# Vivado block design base, xc7z020clg400-1, Vivado 2020.1
# (continued, part 2 of 4)
current_bd_instance /video

create_bd_cell -type hier hdmi_in
create_bd_cell -type hier hdmi_out
create_bd_cell -type ip -vlnv xilinx.com:ip:proc_sys_reset:5.0 proc_sys_reset_pixelclk
create_bd_cell -type ip -vlnv xilinx.com:ip:xlconcat:2.1 xlconcat_0
set_property -dict {CONFIG.NUM_PORTS 6} [get_bd_cells xlconcat_0]
create_bd_cell -type ip -vlnv xilinx.com:ip:axi_interconnect:2.1 axi_interconnect_0
set_property -dict [list \
  CONFIG.M00_HAS_REGSLICE 1 \
  CONFIG.M01_HAS_REGSLICE 1 \
  CONFIG.M02_HAS_REGSLICE 1 \
  CONFIG.M03_HAS_REGSLICE 1 \
  CONFIG.M04_HAS_REGSLICE 1 \
  CONFIG.M05_HAS_REGSLICE 1 \
  CONFIG.M06_HAS_REGSLICE 1 \
  CONFIG.M07_HAS_REGSLICE 1 \
  CONFIG.M08_HAS_REGSLICE 1 \
  CONFIG.M09_HAS_REGSLICE 1 \
  CONFIG.NUM_MI 10 \
  CONFIG.S00_HAS_REGSLICE 1 \
] [get_bd_cells axi_interconnect_0]
create_bd_cell -type ip -vlnv xilinx.com:ip:axi_interconnect:2.1 axi_mem_intercon
set_property -dict {CONFIG.NUM_MI 1 CONFIG.NUM_SI 2} [get_bd_cells axi_mem_intercon]
create_bd_cell -type ip -vlnv xilinx.com:ip:axi_vdma:6.3 axi_vdma
set_property -dict [list \
  CONFIG.c_m_axi_mm2s_data_width 32 \
  CONFIG.c_m_axis_mm2s_tdata_width 32 \
  CONFIG.c_mm2s_genlock_mode 1 \
  CONFIG.c_mm2s_linebuffer_depth 512 \
  CONFIG.c_mm2s_max_burst_length 32 \
  CONFIG.c_num_fstores 4 \
  CONFIG.c_s2mm_genlock_mode 0 \
  CONFIG.c_s2mm_linebuffer_depth 4096 \
  CONFIG.c_s2mm_max_burst_length 32 \
] [get_bd_cells axi_vdma]

# ---- hierarchy /video/hdmi_in ----
current_bd_instance /video/hdmi_in
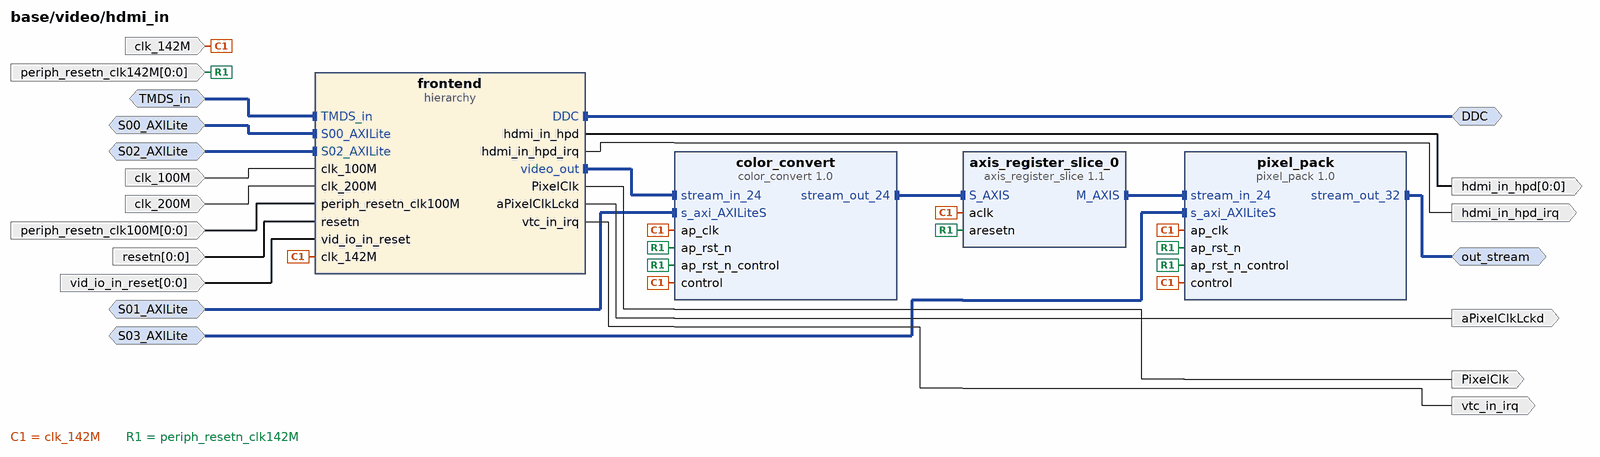
[diagram p19: block diagram inside /video/hdmi_in]
create_bd_intf_pin -mode Master -vlnv xilinx.com:interface:iic_rtl:1.0 DDC
create_bd_intf_pin -mode Slave -vlnv xilinx.com:interface:aximm_rtl:1.0 S00_AXILite
create_bd_intf_pin -mode Slave -vlnv xilinx.com:interface:aximm_rtl:1.0 S01_AXILite
create_bd_intf_pin -mode Slave -vlnv xilinx.com:interface:aximm_rtl:1.0 S02_AXILite
create_bd_intf_pin -mode Slave -vlnv xilinx.com:interface:aximm_rtl:1.0 S03_AXILite
create_bd_intf_pin -mode Slave -vlnv digilentinc.com:interface:tmds_rtl:1.0 TMDS_in
create_bd_intf_pin -mode Master -vlnv xilinx.com:interface:axis_rtl:1.0 out_stream
create_bd_pin -dir O -type clk PixelClk
create_bd_pin -dir O aPixelClkLckd
create_bd_pin -dir I -type clk clk_100M
create_bd_pin -dir I -type clk clk_142M
create_bd_pin -dir I -type clk clk_200M
create_bd_pin -dir O -from 0 -to 0 hdmi_in_hpd
create_bd_pin -dir O -type intr hdmi_in_hpd_irq
create_bd_pin -dir I -from 0 -to 0 -type rst periph_resetn_clk100M
create_bd_pin -dir I -from 0 -to 0 -type rst periph_resetn_clk142M
create_bd_pin -dir I -from 0 -to 0 -type rst resetn
create_bd_pin -dir I -from 0 -to 0 -type rst vid_io_in_reset
create_bd_pin -dir O -type intr vtc_in_irq

create_bd_cell -type hier frontend
create_bd_cell -type ip -vlnv xilinx.com:ip:axis_register_slice:1.1 axis_register_slice_0
create_bd_cell -type ip -vlnv xilinx.com:hls:color_convert:1.0 color_convert
create_bd_cell -type ip -vlnv xilinx.com:hls:pixel_pack:1.0 pixel_pack

# ---- hierarchy /video/hdmi_in/frontend ----
current_bd_instance /video/hdmi_in/frontend
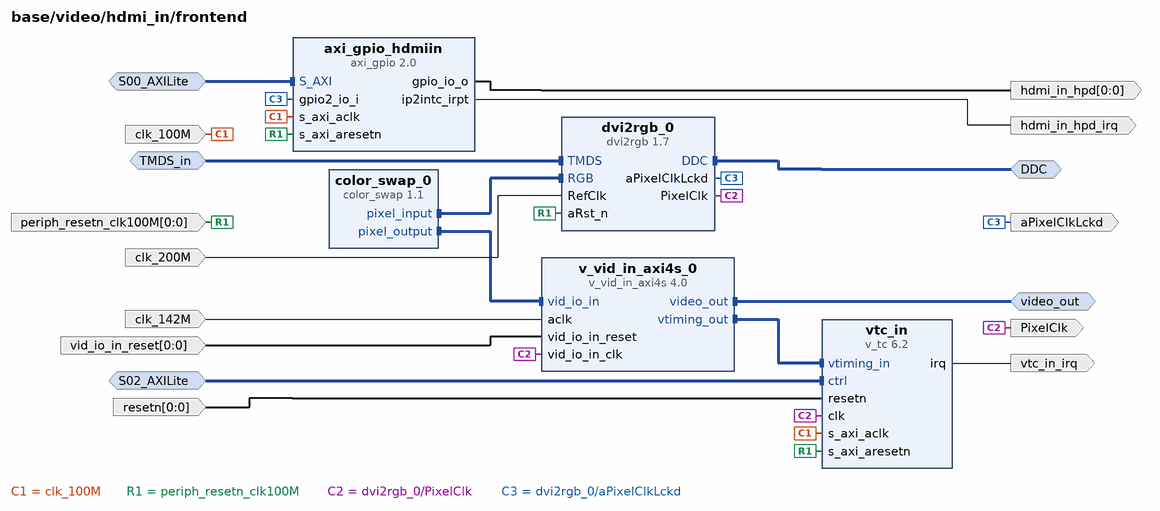
[diagram p20: block diagram inside /video/hdmi_in/frontend]
create_bd_intf_pin -mode Master -vlnv xilinx.com:interface:iic_rtl:1.0 DDC
create_bd_intf_pin -mode Slave -vlnv xilinx.com:interface:aximm_rtl:1.0 S00_AXILite
create_bd_intf_pin -mode Slave -vlnv xilinx.com:interface:aximm_rtl:1.0 S02_AXILite
create_bd_intf_pin -mode Slave -vlnv digilentinc.com:interface:tmds_rtl:1.0 TMDS_in
create_bd_intf_pin -mode Master -vlnv xilinx.com:interface:axis_rtl:1.0 video_out
create_bd_pin -dir O -type clk PixelClk
create_bd_pin -dir O aPixelClkLckd
create_bd_pin -dir I -type clk clk_100M
create_bd_pin -dir I -type clk clk_142M
create_bd_pin -dir I -type clk clk_200M
create_bd_pin -dir O -from 0 -to 0 hdmi_in_hpd
create_bd_pin -dir O -type intr hdmi_in_hpd_irq
create_bd_pin -dir I -from 0 -to 0 -type rst periph_resetn_clk100M
create_bd_pin -dir I -from 0 -to 0 -type rst resetn
create_bd_pin -dir I -from 0 -to 0 -type rst vid_io_in_reset
create_bd_pin -dir O -type intr vtc_in_irq

create_bd_cell -type ip -vlnv xilinx.com:user:color_swap:1.1 color_swap_0
set_property -dict {CONFIG.input_format rbg CONFIG.output_format rgb} [get_bd_cells color_swap_0]
create_bd_cell -type ip -vlnv digilentinc.com:ip:dvi2rgb:1.7 dvi2rgb_0
set_property -dict [list \
  CONFIG.kAddBUFG false \
  CONFIG.kClkRange 1 \
  CONFIG.kEdidFileName 720p_edid.data \
  CONFIG.kRstActiveHigh false \
] [get_bd_cells dvi2rgb_0]
create_bd_cell -type ip -vlnv xilinx.com:ip:v_vid_in_axi4s:4.0 v_vid_in_axi4s_0
set_property -dict {CONFIG.C_ADDR_WIDTH 12 CONFIG.C_HAS_ASYNC_CLK 1} [get_bd_cells v_vid_in_axi4s_0]
create_bd_cell -type ip -vlnv xilinx.com:ip:axi_gpio:2.0 axi_gpio_hdmiin
set_property -dict [list \
  CONFIG.C_ALL_INPUTS_2 1 \
  CONFIG.C_ALL_OUTPUTS 1 \
  CONFIG.C_GPIO2_WIDTH 1 \
  CONFIG.C_GPIO_WIDTH 1 \
  CONFIG.C_INTERRUPT_PRESENT 1 \
  CONFIG.C_IS_DUAL 1 \
] [get_bd_cells axi_gpio_hdmiin]
create_bd_cell -type ip -vlnv xilinx.com:ip:v_tc:6.2 vtc_in
set_property -dict [list \
  CONFIG.HAS_INTC_IF true \
  CONFIG.enable_generation false \
  CONFIG.horizontal_blank_detection false \
  CONFIG.max_lines_per_frame 2048 \
  CONFIG.vertical_blank_detection false \
] [get_bd_cells vtc_in]

# ---- hierarchy /video/hdmi_out ----
current_bd_instance /video/hdmi_out
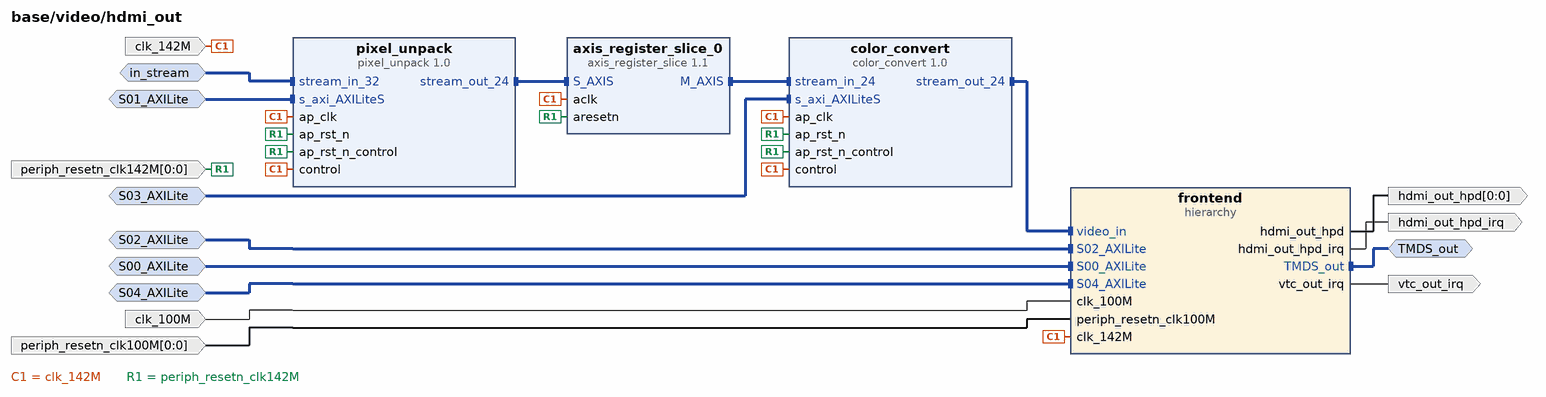
[diagram p21: block diagram inside /video/hdmi_out]
create_bd_intf_pin -mode Slave -vlnv xilinx.com:interface:aximm_rtl:1.0 S00_AXILite
create_bd_intf_pin -mode Slave -vlnv xilinx.com:interface:aximm_rtl:1.0 S01_AXILite
create_bd_intf_pin -mode Slave -vlnv xilinx.com:interface:aximm_rtl:1.0 S02_AXILite
create_bd_intf_pin -mode Slave -vlnv xilinx.com:interface:aximm_rtl:1.0 S03_AXILite
create_bd_intf_pin -mode Slave -vlnv xilinx.com:interface:aximm_rtl:1.0 S04_AXILite
create_bd_intf_pin -mode Master -vlnv digilentinc.com:interface:tmds_rtl:1.0 TMDS_out
create_bd_intf_pin -mode Slave -vlnv xilinx.com:interface:axis_rtl:1.0 in_stream
create_bd_pin -dir I -type clk clk_100M
create_bd_pin -dir I -type clk clk_142M
create_bd_pin -dir O -from 0 -to 0 hdmi_out_hpd
create_bd_pin -dir O -type intr hdmi_out_hpd_irq
create_bd_pin -dir I -from 0 -to 0 -type rst periph_resetn_clk100M
create_bd_pin -dir I -from 0 -to 0 -type rst periph_resetn_clk142M
create_bd_pin -dir O -type intr vtc_out_irq

create_bd_cell -type hier frontend
create_bd_cell -type ip -vlnv xilinx.com:ip:axis_register_slice:1.1 axis_register_slice_0
create_bd_cell -type ip -vlnv xilinx.com:hls:color_convert:1.0 color_convert
create_bd_cell -type ip -vlnv xilinx.com:hls:pixel_unpack:1.0 pixel_unpack

# ---- hierarchy /video/hdmi_out/frontend ----
current_bd_instance /video/hdmi_out/frontend
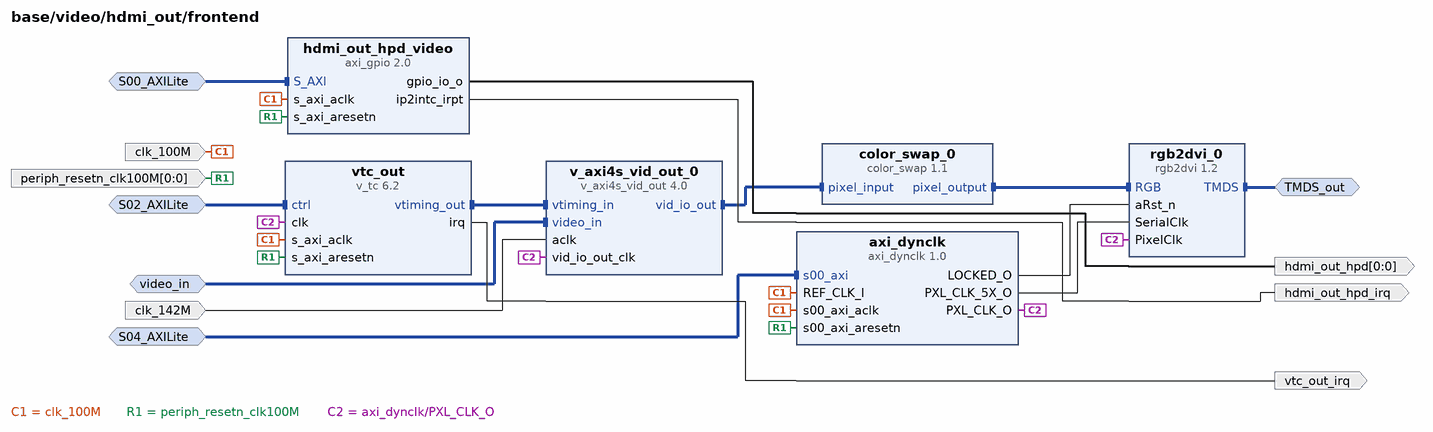
[diagram p22: block diagram inside /video/hdmi_out/frontend]
create_bd_intf_pin -mode Slave -vlnv xilinx.com:interface:aximm_rtl:1.0 S00_AXILite
create_bd_intf_pin -mode Slave -vlnv xilinx.com:interface:aximm_rtl:1.0 S02_AXILite
create_bd_intf_pin -mode Slave -vlnv xilinx.com:interface:aximm_rtl:1.0 S04_AXILite
create_bd_intf_pin -mode Master -vlnv digilentinc.com:interface:tmds_rtl:1.0 TMDS_out
create_bd_intf_pin -mode Slave -vlnv xilinx.com:interface:axis_rtl:1.0 video_in
create_bd_pin -dir I -type clk clk_100M
create_bd_pin -dir I -type clk clk_142M
create_bd_pin -dir O -from 0 -to 0 hdmi_out_hpd
create_bd_pin -dir O -type intr hdmi_out_hpd_irq
create_bd_pin -dir I -from 0 -to 0 -type rst periph_resetn_clk100M
create_bd_pin -dir O -type intr vtc_out_irq

create_bd_cell -type ip -vlnv digilentinc.com:ip:axi_dynclk:1.0 axi_dynclk
create_bd_cell -type ip -vlnv xilinx.com:user:color_swap:1.1 color_swap_0
create_bd_cell -type ip -vlnv digilentinc.com:ip:rgb2dvi:1.2 rgb2dvi_0
set_property -dict {CONFIG.kClkRange 2 CONFIG.kGenerateSerialClk false CONFIG.kRstActiveHigh false} [get_bd_cells rgb2dvi_0]
create_bd_cell -type ip -vlnv xilinx.com:ip:v_axi4s_vid_out:4.0 v_axi4s_vid_out_0
set_property -dict [list \
  CONFIG.C_ADDR_WIDTH 11 \
  CONFIG.C_HAS_ASYNC_CLK 1 \
  CONFIG.C_HYSTERESIS_LEVEL 1024 \
  CONFIG.C_VTG_MASTER_SLAVE 1 \
] [get_bd_cells v_axi4s_vid_out_0]
create_bd_cell -type ip -vlnv xilinx.com:ip:axi_gpio:2.0 hdmi_out_hpd_video
set_property -dict {CONFIG.C_ALL_OUTPUTS 1 CONFIG.C_GPIO_WIDTH 1 CONFIG.C_INTERRUPT_PRESENT 1} [get_bd_cells hdmi_out_hpd_video]
create_bd_cell -type ip -vlnv xilinx.com:ip:v_tc:6.2 vtc_out
set_property -dict {CONFIG.enable_detection false} [get_bd_cells vtc_out]

# ---- hierarchy /wire_distribution_network ----
current_bd_instance /wire_distribution_network
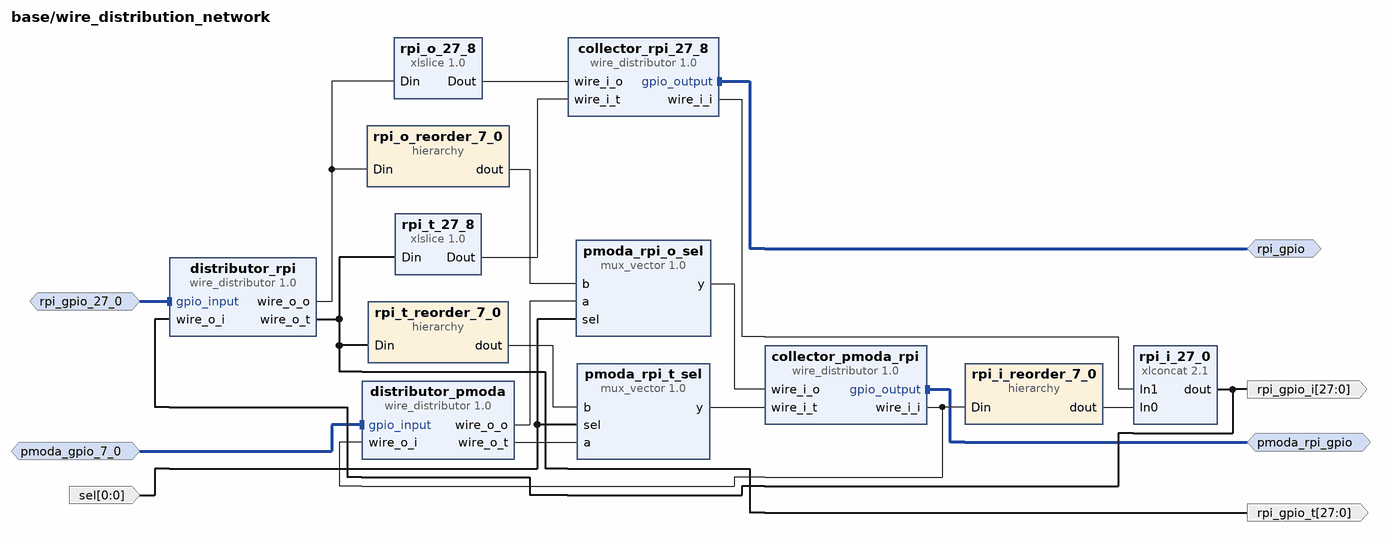
[diagram p23: block diagram inside /wire_distribution_network]
create_bd_intf_pin -mode MirroredMaster -vlnv xilinx.com:interface:gpio_rtl:1.0 pmoda_gpio_7_0
create_bd_intf_pin -mode Master -vlnv xilinx.com:interface:gpio_rtl:1.0 pmoda_rpi_gpio
create_bd_intf_pin -mode Master -vlnv xilinx.com:interface:gpio_rtl:1.0 rpi_gpio
create_bd_intf_pin -mode MirroredMaster -vlnv xilinx.com:interface:gpio_rtl:1.0 rpi_gpio_27_0
create_bd_pin -dir O -from 27 -to 0 rpi_gpio_i
create_bd_pin -dir O -from 27 -to 0 rpi_gpio_t
create_bd_pin -dir I -from 0 -to 0 sel

create_bd_cell -type ip -vlnv xilinx.com:user:wire_distributor:1.0 collector_pmoda_rpi
set_property -dict {CONFIG.TYPE 1 CONFIG.WIDTH 8} [get_bd_cells collector_pmoda_rpi]
create_bd_cell -type ip -vlnv xilinx.com:user:wire_distributor:1.0 collector_rpi_27_8
set_property -dict {CONFIG.TYPE 1 CONFIG.WIDTH 20} [get_bd_cells collector_rpi_27_8]
create_bd_cell -type ip -vlnv xilinx.com:user:wire_distributor:1.0 distributor_pmoda
set_property -dict {CONFIG.WIDTH 8} [get_bd_cells distributor_pmoda]
create_bd_cell -type ip -vlnv xilinx.com:user:wire_distributor:1.0 distributor_rpi
set_property -dict {CONFIG.WIDTH 28} [get_bd_cells distributor_rpi]
create_bd_cell -type ip -vlnv xilinx.com:user:mux_vector:1.0 pmoda_rpi_o_sel
set_property -dict {CONFIG.C_SIZE 8 CONFIG.DELAY 0} [get_bd_cells pmoda_rpi_o_sel]
create_bd_cell -type ip -vlnv xilinx.com:user:mux_vector:1.0 pmoda_rpi_t_sel
set_property -dict {CONFIG.C_SIZE 8 CONFIG.DELAY 0} [get_bd_cells pmoda_rpi_t_sel]
create_bd_cell -type ip -vlnv xilinx.com:ip:xlconcat:2.1 rpi_i_27_0
set_property -dict {CONFIG.IN0_WIDTH 8 CONFIG.IN1_WIDTH 20} [get_bd_cells rpi_i_27_0]
create_bd_cell -type hier rpi_i_reorder_7_0
create_bd_cell -type hier rpi_o_reorder_7_0
create_bd_cell -type hier rpi_t_reorder_7_0
create_bd_cell -type ip -vlnv xilinx.com:ip:xlslice:1.0 rpi_o_27_8
set_property -dict {CONFIG.DIN_FROM 27 CONFIG.DIN_TO 8 CONFIG.DIN_WIDTH 28 CONFIG.DOUT_WIDTH 20} [get_bd_cells rpi_o_27_8]
create_bd_cell -type ip -vlnv xilinx.com:ip:xlslice:1.0 rpi_t_27_8
set_property -dict {CONFIG.DIN_FROM 27 CONFIG.DIN_TO 8 CONFIG.DIN_WIDTH 28 CONFIG.DOUT_WIDTH 20} [get_bd_cells rpi_t_27_8]

# ---- hierarchy /wire_distribution_network/rpi_i_reorder_7_0 ----
current_bd_instance /wire_distribution_network/rpi_i_reorder_7_0
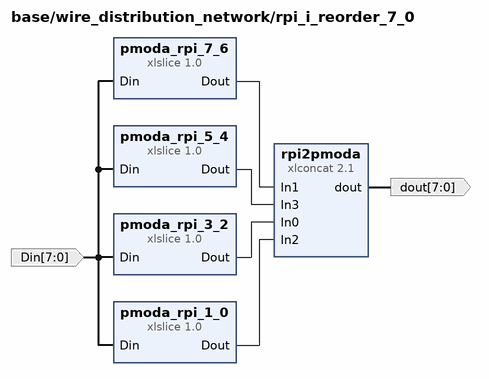
[diagram p24: block diagram inside /wire_distribution_network/rpi_i_reorder_7_0]
create_bd_pin -dir I -from 7 -to 0 Din
create_bd_pin -dir O -from 7 -to 0 dout

create_bd_cell -type ip -vlnv xilinx.com:ip:xlconcat:2.1 rpi2pmoda
set_property -dict [list \
  CONFIG.IN0_WIDTH 2 \
  CONFIG.IN1_WIDTH 2 \
  CONFIG.IN2_WIDTH 2 \
  CONFIG.IN3_WIDTH 2 \
  CONFIG.NUM_PORTS 4 \
] [get_bd_cells rpi2pmoda]
create_bd_cell -type ip -vlnv xilinx.com:ip:xlslice:1.0 pmoda_rpi_1_0
set_property -dict {CONFIG.DIN_FROM 1 CONFIG.DIN_TO 0 CONFIG.DIN_WIDTH 8 CONFIG.DOUT_WIDTH 2} [get_bd_cells pmoda_rpi_1_0]
create_bd_cell -type ip -vlnv xilinx.com:ip:xlslice:1.0 pmoda_rpi_3_2
set_property -dict {CONFIG.DIN_FROM 3 CONFIG.DIN_TO 2 CONFIG.DIN_WIDTH 8 CONFIG.DOUT_WIDTH 2} [get_bd_cells pmoda_rpi_3_2]
create_bd_cell -type ip -vlnv xilinx.com:ip:xlslice:1.0 pmoda_rpi_5_4
set_property -dict {CONFIG.DIN_FROM 5 CONFIG.DIN_TO 4 CONFIG.DIN_WIDTH 8 CONFIG.DOUT_WIDTH 2} [get_bd_cells pmoda_rpi_5_4]
create_bd_cell -type ip -vlnv xilinx.com:ip:xlslice:1.0 pmoda_rpi_7_6
set_property -dict {CONFIG.DIN_FROM 7 CONFIG.DIN_TO 6 CONFIG.DIN_WIDTH 8 CONFIG.DOUT_WIDTH 2} [get_bd_cells pmoda_rpi_7_6]

# ---- hierarchy /wire_distribution_network/rpi_o_reorder_7_0 ----
current_bd_instance /wire_distribution_network/rpi_o_reorder_7_0
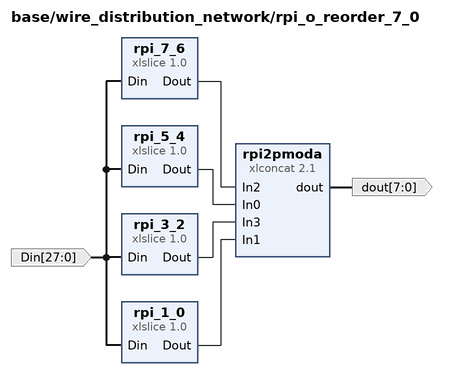
[diagram p25: block diagram inside /wire_distribution_network/rpi_o_reorder_7_0]
create_bd_pin -dir I -from 27 -to 0 Din
create_bd_pin -dir O -from 7 -to 0 dout

create_bd_cell -type ip -vlnv xilinx.com:ip:xlconcat:2.1 rpi2pmoda
set_property -dict [list \
  CONFIG.IN0_WIDTH 2 \
  CONFIG.IN1_WIDTH 2 \
  CONFIG.IN2_WIDTH 2 \
  CONFIG.IN3_WIDTH 2 \
  CONFIG.NUM_PORTS 4 \
] [get_bd_cells rpi2pmoda]
create_bd_cell -type ip -vlnv xilinx.com:ip:xlslice:1.0 rpi_1_0
set_property -dict {CONFIG.DIN_FROM 1 CONFIG.DIN_TO 0 CONFIG.DIN_WIDTH 28 CONFIG.DOUT_WIDTH 2} [get_bd_cells rpi_1_0]
create_bd_cell -type ip -vlnv xilinx.com:ip:xlslice:1.0 rpi_3_2
set_property -dict {CONFIG.DIN_FROM 3 CONFIG.DIN_TO 2 CONFIG.DIN_WIDTH 28 CONFIG.DOUT_WIDTH 2} [get_bd_cells rpi_3_2]
create_bd_cell -type ip -vlnv xilinx.com:ip:xlslice:1.0 rpi_5_4
set_property -dict {CONFIG.DIN_FROM 5 CONFIG.DIN_TO 4 CONFIG.DIN_WIDTH 28 CONFIG.DOUT_WIDTH 2} [get_bd_cells rpi_5_4]
create_bd_cell -type ip -vlnv xilinx.com:ip:xlslice:1.0 rpi_7_6
set_property -dict {CONFIG.DIN_FROM 7 CONFIG.DIN_TO 6 CONFIG.DIN_WIDTH 28 CONFIG.DOUT_WIDTH 2} [get_bd_cells rpi_7_6]

# ---- hierarchy /wire_distribution_network/rpi_t_reorder_7_0 ----
current_bd_instance /wire_distribution_network/rpi_t_reorder_7_0
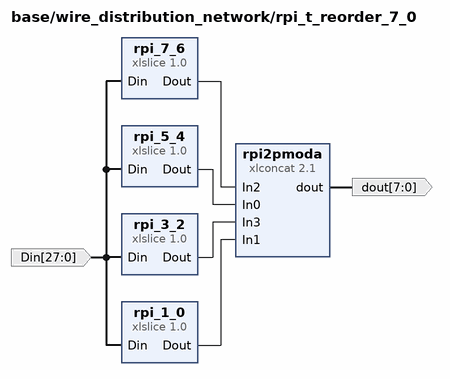
[diagram p26: block diagram inside /wire_distribution_network/rpi_t_reorder_7_0]
create_bd_pin -dir I -from 27 -to 0 Din
create_bd_pin -dir O -from 7 -to 0 dout

create_bd_cell -type ip -vlnv xilinx.com:ip:xlconcat:2.1 rpi2pmoda
set_property -dict [list \
  CONFIG.IN0_WIDTH 2 \
  CONFIG.IN1_WIDTH 2 \
  CONFIG.IN2_WIDTH 2 \
  CONFIG.IN3_WIDTH 2 \
  CONFIG.NUM_PORTS 4 \
] [get_bd_cells rpi2pmoda]
create_bd_cell -type ip -vlnv xilinx.com:ip:xlslice:1.0 rpi_1_0
set_property -dict {CONFIG.DIN_FROM 1 CONFIG.DIN_TO 0 CONFIG.DIN_WIDTH 28 CONFIG.DOUT_WIDTH 2} [get_bd_cells rpi_1_0]
create_bd_cell -type ip -vlnv xilinx.com:ip:xlslice:1.0 rpi_3_2
set_property -dict {CONFIG.DIN_FROM 3 CONFIG.DIN_TO 2 CONFIG.DIN_WIDTH 28 CONFIG.DOUT_WIDTH 2} [get_bd_cells rpi_3_2]
create_bd_cell -type ip -vlnv xilinx.com:ip:xlslice:1.0 rpi_5_4
set_property -dict {CONFIG.DIN_FROM 5 CONFIG.DIN_TO 4 CONFIG.DIN_WIDTH 28 CONFIG.DOUT_WIDTH 2} [get_bd_cells rpi_5_4]
create_bd_cell -type ip -vlnv xilinx.com:ip:xlslice:1.0 rpi_7_6
set_property -dict {CONFIG.DIN_FROM 7 CONFIG.DIN_TO 6 CONFIG.DIN_WIDTH 28 CONFIG.DOUT_WIDTH 2} [get_bd_cells rpi_7_6]

# ---- connections ----

current_bd_instance /iop_arduino
connect_bd_intf_net [get_bd_intf_pins microblaze_0_axi_periph/M11_AXI] [get_bd_intf_pins timers_subsystem/S02_AXILite]
connect_bd_intf_net [get_bd_intf_pins Vaux5] [get_bd_intf_pins xadc/Vaux5]
connect_bd_intf_net [get_bd_intf_pins io_switch/spi0] [get_bd_intf_pins spi_subsystem/SPI_shared]
connect_bd_intf_net [get_bd_intf_pins lmb/DLMB] [get_bd_intf_pins mb/DLMB]
connect_bd_intf_net [get_bd_intf_pins Vaux6] [get_bd_intf_pins xadc/Vaux6]
connect_bd_intf_net [get_bd_intf_pins lmb/ILMB] [get_bd_intf_pins mb/ILMB]
connect_bd_intf_net [get_bd_intf_pins microblaze_0_axi_periph/M10_AXI] [get_bd_intf_pins timers_subsystem/S01_AXILite]
connect_bd_intf_net [get_bd_intf_pins microblaze_0_axi_periph/M06_AXI] [get_bd_intf_pins spi_subsystem/S01_AXILite]
connect_bd_intf_net [get_bd_intf_pins lmb/BRAM_PORTB] [get_bd_intf_pins mb_bram_ctrl/BRAM_PORTA]
connect_bd_intf_net [get_bd_intf_pins Vaux15] [get_bd_intf_pins xadc/Vaux15]
connect_bd_intf_net [get_bd_intf_pins microblaze_0_axi_periph/M00_AXI] [get_bd_intf_pins spi_subsystem/S00_AXILite]
connect_bd_intf_net [get_bd_intf_pins intc/s_axi] [get_bd_intf_pins microblaze_0_axi_periph/M04_AXI]
connect_bd_intf_net [get_bd_intf_pins DEBUG] [get_bd_intf_pins mb/DEBUG]
connect_bd_intf_net [get_bd_intf_pins Vaux1] [get_bd_intf_pins xadc/Vaux1]
connect_bd_intf_net [get_bd_intf_pins microblaze_0_axi_periph/M12_AXI] [get_bd_intf_pins timers_subsystem/S03_AXILite]
connect_bd_intf_net [get_bd_intf_pins S_AXI] [get_bd_intf_pins mb_bram_ctrl/S_AXI]
connect_bd_intf_net [get_bd_intf_pins Vaux9] [get_bd_intf_pins xadc/Vaux9]
connect_bd_intf_net [get_bd_intf_pins microblaze_0_axi_periph/M09_AXI] [get_bd_intf_pins timers_subsystem/S00_AXILite]
connect_bd_intf_net [get_bd_intf_pins microblaze_0_axi_periph/M08_AXI] [get_bd_intf_pins uartlite/S_AXI]
connect_bd_intf_net [get_bd_intf_pins iic_direct/S_AXI] [get_bd_intf_pins microblaze_0_axi_periph/M01_AXI]
connect_bd_intf_net [get_bd_intf_pins Vaux13] [get_bd_intf_pins xadc/Vaux13]
connect_bd_intf_net [get_bd_intf_pins microblaze_0_axi_periph/M13_AXI] [get_bd_intf_pins timers_subsystem/S04_AXILite]
connect_bd_intf_net [get_bd_intf_pins microblaze_0_axi_periph/M16_AXI] [get_bd_intf_pins timers_subsystem/S05_AXILite]
connect_bd_intf_net [get_bd_intf_pins intr/S_AXI] [get_bd_intf_pins microblaze_0_axi_periph/M03_AXI]
connect_bd_intf_net [get_bd_intf_pins microblaze_0_axi_periph/M15_AXI] [get_bd_intf_pins xadc/s_axi_lite]
connect_bd_intf_net [get_bd_intf_pins mb/M_AXI_DP] [get_bd_intf_pins microblaze_0_axi_periph/S00_AXI]
connect_bd_intf_net [get_bd_intf_pins io_switch/uart0] [get_bd_intf_pins uartlite/UART]
connect_bd_intf_net [get_bd_intf_pins arduino_direct_spi] [get_bd_intf_pins spi_subsystem/spi_direct]
connect_bd_intf_net [get_bd_intf_pins arduino_gpio/S_AXI] [get_bd_intf_pins microblaze_0_axi_periph/M05_AXI]
connect_bd_intf_net [get_bd_intf_pins arduino_gpio] [get_bd_intf_pins io_switch/io]
connect_bd_intf_net [get_bd_intf_pins Vp_Vn] [get_bd_intf_pins xadc/Vp_Vn]
connect_bd_intf_net [get_bd_intf_pins M_AXI] [get_bd_intf_pins microblaze_0_axi_periph/M14_AXI]
connect_bd_intf_net [get_bd_intf_pins io_switch/S_AXI] [get_bd_intf_pins microblaze_0_axi_periph/M02_AXI]
connect_bd_intf_net [get_bd_intf_pins arduino_direct_iic] [get_bd_intf_pins iic_direct/IIC]
connect_bd_intf_net [get_bd_intf_pins intc/interrupt] [get_bd_intf_pins mb/INTERRUPT]
connect_bd_intf_net [get_bd_intf_pins arduino_gpio/GPIO] [get_bd_intf_pins io_switch/gpio]
connect_bd_net -net capture_i_1 [get_bd_pins io_switch/timer_i] [get_bd_pins timers_subsystem/capture_i]
connect_bd_net [get_bd_pins dff_en_reset_vector_0/q] [get_bd_pins intr_req]
connect_bd_net [get_bd_pins logic_1/dout] [get_bd_pins dff_en_reset_vector_0/d] [get_bd_pins rst_clk_wiz_1_100M/ext_reset_in]
connect_bd_net -net mb3_concat_dout [get_bd_pins interrupt_concat/dout] [get_bd_pins intc/intr]
connect_bd_net -net mb3_gpio_subsystem_ip2intc_irpt [get_bd_pins arduino_gpio/ip2intc_irpt] [get_bd_pins interrupt_concat/In5]
connect_bd_net -net mb3_iic_subsystem_iic2intc_irpt [get_bd_pins iic_direct/iic2intc_irpt] [get_bd_pins interrupt_concat/In1]
connect_bd_net -net mb3_intr_ack_1 [get_bd_pins intr_ack] [get_bd_pins dff_en_reset_vector_0/reset]
connect_bd_net -net mb3_intr_gpio_io_o [get_bd_pins intr/gpio_io_o] [get_bd_pins dff_en_reset_vector_0/en]
connect_bd_net -net mb3_spi_subsystem_ip2intc_irpt [get_bd_pins spi_subsystem/ip2intc_irpt] [get_bd_pins interrupt_concat/In2]
connect_bd_net -net mb3_spi_subsystem_ip2intc_irpt1 [get_bd_pins spi_subsystem/ip2intc_irpt1] [get_bd_pins interrupt_concat/In3]
connect_bd_net -net mb3_timers_subsystem_mb3_timer_interrupts [get_bd_pins timers_subsystem/mb3_timer_interrupts] [get_bd_pins interrupt_concat/In0]
connect_bd_net -net mb3_uartlite_interrupt [get_bd_pins uartlite/interrupt] [get_bd_pins interrupt_concat/In4]
connect_bd_net -net mb_1_reset_Dout [get_bd_pins aux_reset_in] [get_bd_pins rst_clk_wiz_1_100M/aux_reset_in]
connect_bd_net -net mdm_1_debug_sys_rst [get_bd_pins mb_debug_sys_rst] [get_bd_pins rst_clk_wiz_1_100M/mb_debug_sys_rst]
connect_bd_net -net ps7_0_FCLK_CLK0 [get_bd_pins clk_100M] \
  [get_bd_pins dff_en_reset_vector_0/clk] [get_bd_pins io_switch/s_axi_aclk] [get_bd_pins lmb/LMB_Clk] \
  [get_bd_pins rst_clk_wiz_1_100M/slowest_sync_clk] [get_bd_pins spi_subsystem/s_axi_aclk] \
  [get_bd_pins timers_subsystem/s_axi_aclk] [get_bd_pins arduino_gpio/s_axi_aclk] [get_bd_pins iic_direct/s_axi_aclk] \
  [get_bd_pins intc/s_axi_aclk] [get_bd_pins intr/s_axi_aclk] [get_bd_pins mb/Clk] [get_bd_pins mb_bram_ctrl/s_axi_aclk] \
  [get_bd_pins microblaze_0_axi_periph/ACLK] [get_bd_pins microblaze_0_axi_periph/S00_ACLK] \
  [get_bd_pins microblaze_0_axi_periph/M00_ACLK] [get_bd_pins microblaze_0_axi_periph/M01_ACLK] \
  [get_bd_pins microblaze_0_axi_periph/M02_ACLK] [get_bd_pins microblaze_0_axi_periph/M03_ACLK] \
  [get_bd_pins microblaze_0_axi_periph/M04_ACLK] [get_bd_pins microblaze_0_axi_periph/M05_ACLK] \
  [get_bd_pins microblaze_0_axi_periph/M06_ACLK] [get_bd_pins microblaze_0_axi_periph/M07_ACLK] \
  [get_bd_pins microblaze_0_axi_periph/M08_ACLK] [get_bd_pins microblaze_0_axi_periph/M09_ACLK] \
  [get_bd_pins microblaze_0_axi_periph/M10_ACLK] [get_bd_pins microblaze_0_axi_periph/M11_ACLK] \
  [get_bd_pins microblaze_0_axi_periph/M12_ACLK] [get_bd_pins microblaze_0_axi_periph/M13_ACLK] \
  [get_bd_pins microblaze_0_axi_periph/M14_ACLK] [get_bd_pins microblaze_0_axi_periph/M15_ACLK] \
  [get_bd_pins microblaze_0_axi_periph/M16_ACLK] [get_bd_pins uartlite/s_axi_aclk] [get_bd_pins xadc/s_axi_aclk]
connect_bd_net [get_bd_pins rst_clk_wiz_1_100M/bus_struct_reset] [get_bd_pins lmb/SYS_Rst]
connect_bd_net [get_bd_pins rst_clk_wiz_1_100M/interconnect_aresetn] [get_bd_pins microblaze_0_axi_periph/ARESETN]
connect_bd_net [get_bd_pins rst_clk_wiz_1_100M/mb_reset] [get_bd_pins mb/Reset]
connect_bd_net [get_bd_pins rst_clk_wiz_1_100M/peripheral_aresetn] \
  [get_bd_pins peripheral_aresetn] [get_bd_pins io_switch/s_axi_aresetn] [get_bd_pins spi_subsystem/s_axi_aresetn] \
  [get_bd_pins timers_subsystem/s_axi_aresetn] [get_bd_pins arduino_gpio/s_axi_aresetn] \
  [get_bd_pins iic_direct/s_axi_aresetn] [get_bd_pins intc/s_axi_aresetn] [get_bd_pins microblaze_0_axi_periph/S00_ARESETN] \
  [get_bd_pins microblaze_0_axi_periph/M00_ARESETN] [get_bd_pins microblaze_0_axi_periph/M01_ARESETN] \
  [get_bd_pins microblaze_0_axi_periph/M02_ARESETN] [get_bd_pins microblaze_0_axi_periph/M03_ARESETN] \
  [get_bd_pins microblaze_0_axi_periph/M04_ARESETN] [get_bd_pins microblaze_0_axi_periph/M05_ARESETN] \
  [get_bd_pins microblaze_0_axi_periph/M06_ARESETN] [get_bd_pins microblaze_0_axi_periph/M07_ARESETN] \
  [get_bd_pins microblaze_0_axi_periph/M10_ARESETN] [get_bd_pins microblaze_0_axi_periph/M11_ARESETN] \
  [get_bd_pins microblaze_0_axi_periph/M12_ARESETN] [get_bd_pins microblaze_0_axi_periph/M13_ARESETN] \
  [get_bd_pins microblaze_0_axi_periph/M15_ARESETN]
connect_bd_net [get_bd_pins s_axi_aresetn] \
  [get_bd_pins spi_subsystem/s_axi_aresetn1] [get_bd_pins timers_subsystem/s_axi_aresetn1] [get_bd_pins intr/s_axi_aresetn] \
  [get_bd_pins mb_bram_ctrl/s_axi_aresetn] [get_bd_pins microblaze_0_axi_periph/M08_ARESETN] \
  [get_bd_pins microblaze_0_axi_periph/M09_ARESETN] [get_bd_pins microblaze_0_axi_periph/M14_ARESETN] \
  [get_bd_pins microblaze_0_axi_periph/M16_ARESETN] [get_bd_pins uartlite/s_axi_aresetn] [get_bd_pins xadc/s_axi_aresetn]
connect_bd_net [get_bd_pins timers_subsystem/generate_o] [get_bd_pins io_switch/timer_o]
connect_bd_net [get_bd_pins timers_subsystem/pwm_o] [get_bd_pins io_switch/pwm_o]
set_property HDL_ATTRIBUTE.BMM_INFO_PROCESSOR {microblaze-le > base iop_arduino/lmb/lmb_bram_if_cntlr} [get_bd_cells mb]
set_property HDL_ATTRIBUTE.KEEP_HIERARCHY yes [get_bd_cells mb]
set_property HDL_ATTRIBUTE.BMM_INFO_ADDRESS_SPACE {byte  0x44000000 32 > base iop_arduino/lmb/lmb_bram} [get_bd_cells mb_bram_ctrl]
set_property HDL_ATTRIBUTE.KEEP_HIERARCHY yes [get_bd_cells mb_bram_ctrl]

current_bd_instance /iop_arduino/lmb
connect_bd_intf_net [get_bd_intf_pins DLMB] [get_bd_intf_pins dlmb_v10/LMB_M]
connect_bd_intf_net [get_bd_intf_pins lmb_bram/BRAM_PORTA] [get_bd_intf_pins lmb_bram_if_cntlr/BRAM_PORT]
connect_bd_intf_net [get_bd_intf_pins ilmb_v10/LMB_Sl_0] [get_bd_intf_pins lmb_bram_if_cntlr/SLMB]
connect_bd_intf_net [get_bd_intf_pins dlmb_v10/LMB_Sl_0] [get_bd_intf_pins lmb_bram_if_cntlr/SLMB1]
connect_bd_intf_net [get_bd_intf_pins BRAM_PORTB] [get_bd_intf_pins lmb_bram/BRAM_PORTB]
connect_bd_intf_net [get_bd_intf_pins ILMB] [get_bd_intf_pins ilmb_v10/LMB_M]
connect_bd_net [get_bd_pins SYS_Rst] [get_bd_pins dlmb_v10/SYS_Rst] [get_bd_pins ilmb_v10/SYS_Rst] [get_bd_pins lmb_bram_if_cntlr/LMB_Rst]
connect_bd_net -net microblaze_0_Clk [get_bd_pins LMB_Clk] \
  [get_bd_pins dlmb_v10/LMB_Clk] [get_bd_pins ilmb_v10/LMB_Clk] [get_bd_pins lmb_bram_if_cntlr/LMB_Clk]
set_property HDL_ATTRIBUTE.BMM_INFO_ADDRESS_SPACE {byte  0x00000000 32 > base iop_arduino/lmb/lmb_bram} [get_bd_cells lmb_bram_if_cntlr]
set_property HDL_ATTRIBUTE.KEEP_HIERARCHY yes [get_bd_cells lmb_bram_if_cntlr]

current_bd_instance /iop_arduino/spi_subsystem
connect_bd_intf_net [get_bd_intf_pins S01_AXILite] [get_bd_intf_pins spi_shared/AXI_LITE]
connect_bd_intf_net [get_bd_intf_pins SPI_shared] [get_bd_intf_pins spi_shared/SPI_0]
connect_bd_intf_net [get_bd_intf_pins spi_direct] [get_bd_intf_pins spi_direct/SPI_0]
connect_bd_intf_net [get_bd_intf_pins S00_AXILite] [get_bd_intf_pins spi_direct/AXI_LITE]
connect_bd_net -net mb3_spi_ip2intc_irpt [get_bd_pins spi_direct/ip2intc_irpt] [get_bd_pins ip2intc_irpt]
connect_bd_net -net mb3_spi_pl_sw_d13_d10_ip2intc_irpt [get_bd_pins spi_shared/ip2intc_irpt] [get_bd_pins ip2intc_irpt1]
connect_bd_net -net ps7_0_FCLK_CLK0 [get_bd_pins s_axi_aclk] \
  [get_bd_pins spi_direct/ext_spi_clk] [get_bd_pins spi_direct/s_axi_aclk] [get_bd_pins spi_shared/ext_spi_clk] \
  [get_bd_pins spi_shared/s_axi_aclk]
connect_bd_net -net rst_clk_wiz_1_100M_peripheral_aresetn [get_bd_pins s_axi_aresetn] [get_bd_pins spi_direct/s_axi_aresetn]
connect_bd_net [get_bd_pins s_axi_aresetn1] [get_bd_pins spi_shared/s_axi_aresetn]

current_bd_instance /iop_arduino/timers_subsystem
connect_bd_intf_net [get_bd_intf_pins S04_AXILite] [get_bd_intf_pins timer_4/S_AXI]
connect_bd_intf_net [get_bd_intf_pins S05_AXILite] [get_bd_intf_pins timer_5/S_AXI]
connect_bd_intf_net [get_bd_intf_pins S03_AXILite] [get_bd_intf_pins timer_3/S_AXI]
connect_bd_intf_net [get_bd_intf_pins S02_AXILite] [get_bd_intf_pins timer_2/S_AXI]
connect_bd_intf_net [get_bd_intf_pins S00_AXILite] [get_bd_intf_pins timer_0/S_AXI]
connect_bd_intf_net [get_bd_intf_pins S01_AXILite] [get_bd_intf_pins timer_1/S_AXI]
connect_bd_net -net arduino_io_switch_0_timer_i_in [get_bd_pins capture_i] \
  [get_bd_pins mb3_timer_capture_0/Din] [get_bd_pins mb3_timer_capture_1/Din] [get_bd_pins mb3_timer_capture_2/Din] \
  [get_bd_pins mb3_timer_capture_3/Din] [get_bd_pins mb3_timer_capture_4/Din] [get_bd_pins mb3_timer_capture_5/Din] \
  [get_bd_pins mb3_timer_capture_6/Din] [get_bd_pins mb3_timer_capture_7/Din]
connect_bd_net -net mb3_timer_0_generateout0 [get_bd_pins timer_0/generateout0] [get_bd_pins mb3_timer_generate/In0]
connect_bd_net -net mb3_timer_0_interrupt [get_bd_pins timer_0/interrupt] [get_bd_pins mb3_timers_interrupt/In0]
connect_bd_net -net mb3_timer_0_pwm0 [get_bd_pins timer_0/pwm0] [get_bd_pins mb3_timer_pwm/In0]
connect_bd_net -net mb3_timer_1_generateout0 [get_bd_pins timer_1/generateout0] [get_bd_pins mb3_timer_generate/In1]
connect_bd_net -net mb3_timer_1_interrupt [get_bd_pins timer_1/interrupt] [get_bd_pins mb3_timers_interrupt/In1]
connect_bd_net -net mb3_timer_1_pwm0 [get_bd_pins timer_1/pwm0] [get_bd_pins mb3_timer_pwm/In1]
connect_bd_net -net mb3_timer_2_generateout0 [get_bd_pins timer_2/generateout0] [get_bd_pins mb3_timer_generate/In2]
connect_bd_net -net mb3_timer_2_interrupt [get_bd_pins timer_2/interrupt] [get_bd_pins mb3_timers_interrupt/In2]
connect_bd_net -net mb3_timer_2_pwm0 [get_bd_pins timer_2/pwm0] [get_bd_pins mb3_timer_pwm/In2]
connect_bd_net -net mb3_timer_3_generateout0 [get_bd_pins timer_3/generateout0] [get_bd_pins mb3_timer_generate/In3]
connect_bd_net -net mb3_timer_3_interrupt [get_bd_pins timer_3/interrupt] [get_bd_pins mb3_timers_interrupt/In3]
connect_bd_net -net mb3_timer_3_pwm0 [get_bd_pins timer_3/pwm0] [get_bd_pins mb3_timer_pwm/In3]
connect_bd_net -net mb3_timer_4_generateout0 [get_bd_pins timer_4/generateout0] [get_bd_pins mb3_timer_generate/In4]
connect_bd_net -net mb3_timer_4_interrupt [get_bd_pins timer_4/interrupt] [get_bd_pins mb3_timers_interrupt/In4]
connect_bd_net -net mb3_timer_4_pwm0 [get_bd_pins timer_4/pwm0] [get_bd_pins mb3_timer_pwm/In4]
connect_bd_net -net mb3_timer_5_generateout0 [get_bd_pins timer_5/generateout0] [get_bd_pins mb3_timer_generate/In5]
connect_bd_net -net mb3_timer_5_interrupt [get_bd_pins timer_5/interrupt] [get_bd_pins mb3_timers_interrupt/In5]
connect_bd_net -net mb3_timer_5_pwm0 [get_bd_pins timer_5/pwm0] [get_bd_pins mb3_timer_pwm/In5]
connect_bd_net [get_bd_pins mb3_timer_capture_0/Dout] [get_bd_pins timer_0/capturetrig0]
connect_bd_net [get_bd_pins mb3_timer_capture_1/Dout] [get_bd_pins timer_1/capturetrig0]
connect_bd_net [get_bd_pins mb3_timer_capture_2/Dout] [get_bd_pins timer_2/capturetrig0]
connect_bd_net [get_bd_pins mb3_timer_capture_3/Dout] [get_bd_pins timer_3/capturetrig0]
connect_bd_net [get_bd_pins mb3_timer_capture_4/Dout] [get_bd_pins timer_4/capturetrig0]
connect_bd_net [get_bd_pins mb3_timer_capture_5/Dout] [get_bd_pins timer_5/capturetrig0]
connect_bd_net [get_bd_pins mb3_timer_capture_6/Dout] [get_bd_pins timer_1/capturetrig1]
connect_bd_net [get_bd_pins mb3_timer_capture_7/Dout] [get_bd_pins timer_2/capturetrig1]
connect_bd_net [get_bd_pins mb3_timer_generate/dout] [get_bd_pins generate_o]
connect_bd_net [get_bd_pins mb3_timer_pwm/dout] [get_bd_pins pwm_o]
connect_bd_net [get_bd_pins mb3_timers_interrupt/dout] [get_bd_pins mb3_timer_interrupts]
connect_bd_net -net ps7_0_FCLK_CLK0 [get_bd_pins s_axi_aclk] \
  [get_bd_pins timer_0/s_axi_aclk] [get_bd_pins timer_1/s_axi_aclk] [get_bd_pins timer_2/s_axi_aclk] \
  [get_bd_pins timer_3/s_axi_aclk] [get_bd_pins timer_4/s_axi_aclk] [get_bd_pins timer_5/s_axi_aclk]
connect_bd_net -net rst_clk_wiz_1_100M_peripheral_aresetn [get_bd_pins s_axi_aresetn] [get_bd_pins timer_0/s_axi_aresetn]
connect_bd_net [get_bd_pins s_axi_aresetn1] \
  [get_bd_pins timer_1/s_axi_aresetn] [get_bd_pins timer_2/s_axi_aresetn] [get_bd_pins timer_3/s_axi_aresetn] \
  [get_bd_pins timer_4/s_axi_aresetn] [get_bd_pins timer_5/s_axi_aresetn]
connect_bd_net [get_bd_pins timer_1/generateout1] [get_bd_pins mb3_timer_generate/In6]
connect_bd_net [get_bd_pins timer_2/generateout1] [get_bd_pins mb3_timer_generate/In7]

current_bd_instance /iop_pmoda
connect_bd_intf_net [get_bd_intf_pins io_switch/spi0] [get_bd_intf_pins spi/SPI_0]
connect_bd_intf_net [get_bd_intf_pins M_AXI] [get_bd_intf_pins microblaze_0_axi_periph/M07_AXI]
connect_bd_intf_net [get_bd_intf_pins intc/interrupt] [get_bd_intf_pins mb/INTERRUPT]
connect_bd_intf_net [get_bd_intf_pins microblaze_0_axi_periph/M04_AXI] [get_bd_intf_pins timer/S_AXI]
connect_bd_intf_net [get_bd_intf_pins DEBUG] [get_bd_intf_pins mb/DEBUG]
connect_bd_intf_net [get_bd_intf_pins intr/S_AXI] [get_bd_intf_pins microblaze_0_axi_periph/M06_AXI]
connect_bd_intf_net [get_bd_intf_pins lmb/DLMB] [get_bd_intf_pins mb/DLMB]
connect_bd_intf_net [get_bd_intf_pins lmb/BRAM_PORTB] [get_bd_intf_pins mb_bram_ctrl/BRAM_PORTA]
connect_bd_intf_net [get_bd_intf_pins gpio/S_AXI] [get_bd_intf_pins microblaze_0_axi_periph/M03_AXI]
connect_bd_intf_net [get_bd_intf_pins iic/S_AXI] [get_bd_intf_pins microblaze_0_axi_periph/M01_AXI]
connect_bd_intf_net [get_bd_intf_pins lmb/ILMB] [get_bd_intf_pins mb/ILMB]
connect_bd_intf_net [get_bd_intf_pins iic/IIC] [get_bd_intf_pins io_switch/iic0]
connect_bd_intf_net [get_bd_intf_pins gpio/GPIO] [get_bd_intf_pins io_switch/gpio]
connect_bd_intf_net [get_bd_intf_pins intc/s_axi] [get_bd_intf_pins microblaze_0_axi_periph/M05_AXI]
connect_bd_intf_net [get_bd_intf_pins S_AXI] [get_bd_intf_pins mb_bram_ctrl/S_AXI]
connect_bd_intf_net [get_bd_intf_pins pmoda_gpio] [get_bd_intf_pins io_switch/io]
connect_bd_intf_net [get_bd_intf_pins microblaze_0_axi_periph/M00_AXI] [get_bd_intf_pins spi/AXI_LITE]
connect_bd_intf_net [get_bd_intf_pins io_switch/S_AXI] [get_bd_intf_pins microblaze_0_axi_periph/M02_AXI]
connect_bd_intf_net [get_bd_intf_pins mb/M_AXI_DP] [get_bd_intf_pins microblaze_0_axi_periph/S00_AXI]
connect_bd_net [get_bd_pins dff_en_reset_vector_0/q] [get_bd_pins intr_req]
connect_bd_net [get_bd_pins io_switch/timer_i] [get_bd_pins timer/capturetrig0]
connect_bd_net -net iop1_intr_ack_1 [get_bd_pins intr_ack] [get_bd_pins dff_en_reset_vector_0/reset]
connect_bd_net -net iop1_intr_gpio_io_o [get_bd_pins intr/gpio_io_o] [get_bd_pins dff_en_reset_vector_0/en]
connect_bd_net [get_bd_pins logic_1/dout] [get_bd_pins dff_en_reset_vector_0/d] [get_bd_pins rst_clk_wiz_1_100M/ext_reset_in]
connect_bd_net -net mb1_iic_iic2intc_irpt [get_bd_pins iic/iic2intc_irpt] [get_bd_pins intr_concat/In0]
connect_bd_net -net mb1_interrupt_concat_dout [get_bd_pins intr_concat/dout] [get_bd_pins intc/intr]
connect_bd_net -net mb1_spi_ip2intc_irpt [get_bd_pins spi/ip2intc_irpt] [get_bd_pins intr_concat/In1]
connect_bd_net -net mb1_timer_generateout0 [get_bd_pins timer/generateout0] [get_bd_pins io_switch/timer_o]
connect_bd_net -net mb1_timer_interrupt [get_bd_pins timer/interrupt] [get_bd_pins intr_concat/In2]
connect_bd_net -net mb1_timer_pwm0 [get_bd_pins timer/pwm0] [get_bd_pins io_switch/pwm_o]
connect_bd_net -net mb_1_reset_Dout [get_bd_pins aux_reset_in] [get_bd_pins rst_clk_wiz_1_100M/aux_reset_in]
connect_bd_net -net mdm_1_debug_sys_rst [get_bd_pins mb_debug_sys_rst] [get_bd_pins rst_clk_wiz_1_100M/mb_debug_sys_rst]
connect_bd_net -net ps7_0_FCLK_CLK0 [get_bd_pins clk_100M] \
  [get_bd_pins dff_en_reset_vector_0/clk] [get_bd_pins io_switch/s_axi_aclk] [get_bd_pins lmb/LMB_Clk] \
  [get_bd_pins rst_clk_wiz_1_100M/slowest_sync_clk] [get_bd_pins gpio/s_axi_aclk] [get_bd_pins iic/s_axi_aclk] \
  [get_bd_pins intc/s_axi_aclk] [get_bd_pins intr/s_axi_aclk] [get_bd_pins mb/Clk] [get_bd_pins mb_bram_ctrl/s_axi_aclk] \
  [get_bd_pins microblaze_0_axi_periph/ACLK] [get_bd_pins microblaze_0_axi_periph/S00_ACLK] \
  [get_bd_pins microblaze_0_axi_periph/M00_ACLK] [get_bd_pins microblaze_0_axi_periph/M01_ACLK] \
  [get_bd_pins microblaze_0_axi_periph/M02_ACLK] [get_bd_pins microblaze_0_axi_periph/M03_ACLK] \
  [get_bd_pins microblaze_0_axi_periph/M04_ACLK] [get_bd_pins microblaze_0_axi_periph/M05_ACLK] \
  [get_bd_pins microblaze_0_axi_periph/M06_ACLK] [get_bd_pins microblaze_0_axi_periph/M07_ACLK] [get_bd_pins spi/ext_spi_clk] \
  [get_bd_pins spi/s_axi_aclk] [get_bd_pins timer/s_axi_aclk]
connect_bd_net [get_bd_pins rst_clk_wiz_1_100M/bus_struct_reset] [get_bd_pins lmb/SYS_Rst]
connect_bd_net [get_bd_pins rst_clk_wiz_1_100M/interconnect_aresetn] [get_bd_pins microblaze_0_axi_periph/ARESETN]
connect_bd_net [get_bd_pins rst_clk_wiz_1_100M/mb_reset] [get_bd_pins mb/Reset]
connect_bd_net [get_bd_pins rst_clk_wiz_1_100M/peripheral_aresetn] \
  [get_bd_pins peripheral_aresetn] [get_bd_pins io_switch/s_axi_aresetn] [get_bd_pins gpio/s_axi_aresetn] \
  [get_bd_pins iic/s_axi_aresetn] [get_bd_pins intc/s_axi_aresetn] [get_bd_pins microblaze_0_axi_periph/S00_ARESETN] \
  [get_bd_pins microblaze_0_axi_periph/M00_ARESETN] [get_bd_pins microblaze_0_axi_periph/M01_ARESETN] \
  [get_bd_pins microblaze_0_axi_periph/M02_ARESETN] [get_bd_pins microblaze_0_axi_periph/M03_ARESETN] \
  [get_bd_pins microblaze_0_axi_periph/M04_ARESETN] [get_bd_pins microblaze_0_axi_periph/M05_ARESETN] \
  [get_bd_pins microblaze_0_axi_periph/M06_ARESETN] [get_bd_pins microblaze_0_axi_periph/M07_ARESETN] \
  [get_bd_pins spi/s_axi_aresetn] [get_bd_pins timer/s_axi_aresetn]
connect_bd_net [get_bd_pins s_axi_aresetn] [get_bd_pins intr/s_axi_aresetn] [get_bd_pins mb_bram_ctrl/s_axi_aresetn]
set_property HDL_ATTRIBUTE.BMM_INFO_PROCESSOR {microblaze-le > base iop_pmoda/lmb/lmb_bram_if_cntlr} [get_bd_cells mb]
set_property HDL_ATTRIBUTE.KEEP_HIERARCHY yes [get_bd_cells mb]
set_property HDL_ATTRIBUTE.BMM_INFO_ADDRESS_SPACE {byte  0x40000000 32 > base iop_pmoda/lmb/lmb_bram} [get_bd_cells mb_bram_ctrl]
set_property HDL_ATTRIBUTE.KEEP_HIERARCHY yes [get_bd_cells mb_bram_ctrl]

current_bd_instance /iop_pmoda/lmb
connect_bd_intf_net [get_bd_intf_pins lmb_bram/BRAM_PORTA] [get_bd_intf_pins lmb_bram_if_cntlr/BRAM_PORT]
connect_bd_intf_net [get_bd_intf_pins dlmb_v10/LMB_Sl_0] [get_bd_intf_pins lmb_bram_if_cntlr/SLMB1]
connect_bd_intf_net [get_bd_intf_pins ilmb_v10/LMB_Sl_0] [get_bd_intf_pins lmb_bram_if_cntlr/SLMB]
connect_bd_intf_net [get_bd_intf_pins BRAM_PORTB] [get_bd_intf_pins lmb_bram/BRAM_PORTB]
connect_bd_intf_net [get_bd_intf_pins DLMB] [get_bd_intf_pins dlmb_v10/LMB_M]
connect_bd_intf_net [get_bd_intf_pins ILMB] [get_bd_intf_pins ilmb_v10/LMB_M]
connect_bd_net [get_bd_pins SYS_Rst] [get_bd_pins dlmb_v10/SYS_Rst] [get_bd_pins ilmb_v10/SYS_Rst] [get_bd_pins lmb_bram_if_cntlr/LMB_Rst]
connect_bd_net -net microblaze_0_Clk [get_bd_pins LMB_Clk] \
  [get_bd_pins dlmb_v10/LMB_Clk] [get_bd_pins ilmb_v10/LMB_Clk] [get_bd_pins lmb_bram_if_cntlr/LMB_Clk]
set_property HDL_ATTRIBUTE.BMM_INFO_ADDRESS_SPACE {byte  0x00000000 32 > base iop_pmoda/lmb/lmb_bram} [get_bd_cells lmb_bram_if_cntlr]
set_property HDL_ATTRIBUTE.KEEP_HIERARCHY yes [get_bd_cells lmb_bram_if_cntlr]

current_bd_instance /iop_pmodb
connect_bd_intf_net [get_bd_intf_pins M_AXI] [get_bd_intf_pins microblaze_0_axi_periph/M07_AXI]
connect_bd_intf_net [get_bd_intf_pins S_AXI] [get_bd_intf_pins mb_bram_ctrl/S_AXI]
connect_bd_intf_net [get_bd_intf_pins DEBUG] [get_bd_intf_pins mb/DEBUG]
connect_bd_intf_net [get_bd_intf_pins microblaze_0_axi_periph/M04_AXI] [get_bd_intf_pins timer/S_AXI]
connect_bd_intf_net [get_bd_intf_pins io_switch/spi0] [get_bd_intf_pins spi/SPI_0]
connect_bd_intf_net [get_bd_intf_pins intr/S_AXI] [get_bd_intf_pins microblaze_0_axi_periph/M06_AXI]
connect_bd_intf_net [get_bd_intf_pins microblaze_0_axi_periph/M00_AXI] [get_bd_intf_pins spi/AXI_LITE]
connect_bd_intf_net [get_bd_intf_pins intc/interrupt] [get_bd_intf_pins mb/INTERRUPT]
connect_bd_intf_net [get_bd_intf_pins lmb/BRAM_PORTB] [get_bd_intf_pins mb_bram_ctrl/BRAM_PORTA]
connect_bd_intf_net [get_bd_intf_pins pmodb_gpio] [get_bd_intf_pins io_switch/io]
connect_bd_intf_net [get_bd_intf_pins intc/s_axi] [get_bd_intf_pins microblaze_0_axi_periph/M05_AXI]
connect_bd_intf_net [get_bd_intf_pins lmb/ILMB] [get_bd_intf_pins mb/ILMB]
connect_bd_intf_net [get_bd_intf_pins mb/M_AXI_DP] [get_bd_intf_pins microblaze_0_axi_periph/S00_AXI]
connect_bd_intf_net [get_bd_intf_pins lmb/DLMB] [get_bd_intf_pins mb/DLMB]
connect_bd_intf_net [get_bd_intf_pins iic/IIC] [get_bd_intf_pins io_switch/iic0]
connect_bd_intf_net [get_bd_intf_pins io_switch/S_AXI] [get_bd_intf_pins microblaze_0_axi_periph/M02_AXI]
connect_bd_intf_net [get_bd_intf_pins iic/S_AXI] [get_bd_intf_pins microblaze_0_axi_periph/M01_AXI]
connect_bd_intf_net [get_bd_intf_pins gpio/GPIO] [get_bd_intf_pins io_switch/gpio]
connect_bd_intf_net [get_bd_intf_pins gpio/S_AXI] [get_bd_intf_pins microblaze_0_axi_periph/M03_AXI]
connect_bd_net [get_bd_pins dff_en_reset_vector_0/q] [get_bd_pins intr_req]
connect_bd_net [get_bd_pins io_switch/timer_i] [get_bd_pins timer/capturetrig0]
connect_bd_net -net iop2_intr_ack_1 [get_bd_pins intr_ack] [get_bd_pins dff_en_reset_vector_0/reset]
connect_bd_net -net iop2_intr_gpio_io_o [get_bd_pins intr/gpio_io_o] [get_bd_pins dff_en_reset_vector_0/en]
connect_bd_net [get_bd_pins logic_1/dout] [get_bd_pins dff_en_reset_vector_0/d] [get_bd_pins rst_clk_wiz_1_100M/ext_reset_in]
connect_bd_net -net mb2_concat_dout [get_bd_pins intr_concat/dout] [get_bd_pins intc/intr]
connect_bd_net -net mb2_iic_iic2intc_irpt [get_bd_pins iic/iic2intc_irpt] [get_bd_pins intr_concat/In0]
connect_bd_net -net mb2_spi_ip2intc_irpt [get_bd_pins spi/ip2intc_irpt] [get_bd_pins intr_concat/In1]
connect_bd_net -net mb2_timer_generateout0 [get_bd_pins timer/generateout0] [get_bd_pins io_switch/timer_o]
connect_bd_net -net mb2_timer_interrupt [get_bd_pins timer/interrupt] [get_bd_pins intr_concat/In2]
connect_bd_net -net mb2_timer_pwm0 [get_bd_pins timer/pwm0] [get_bd_pins io_switch/pwm_o]
connect_bd_net -net mb_1_reset_Dout [get_bd_pins aux_reset_in] [get_bd_pins rst_clk_wiz_1_100M/aux_reset_in]
connect_bd_net -net mdm_1_debug_sys_rst [get_bd_pins mb_debug_sys_rst] [get_bd_pins rst_clk_wiz_1_100M/mb_debug_sys_rst]
connect_bd_net -net ps7_0_FCLK_CLK0 [get_bd_pins clk_100M] \
  [get_bd_pins dff_en_reset_vector_0/clk] [get_bd_pins io_switch/s_axi_aclk] [get_bd_pins lmb/LMB_Clk] \
  [get_bd_pins rst_clk_wiz_1_100M/slowest_sync_clk] [get_bd_pins gpio/s_axi_aclk] [get_bd_pins iic/s_axi_aclk] \
  [get_bd_pins intc/s_axi_aclk] [get_bd_pins intr/s_axi_aclk] [get_bd_pins mb/Clk] [get_bd_pins mb_bram_ctrl/s_axi_aclk] \
  [get_bd_pins microblaze_0_axi_periph/ACLK] [get_bd_pins microblaze_0_axi_periph/S00_ACLK] \
  [get_bd_pins microblaze_0_axi_periph/M00_ACLK] [get_bd_pins microblaze_0_axi_periph/M01_ACLK] \
  [get_bd_pins microblaze_0_axi_periph/M02_ACLK] [get_bd_pins microblaze_0_axi_periph/M03_ACLK] \
  [get_bd_pins microblaze_0_axi_periph/M04_ACLK] [get_bd_pins microblaze_0_axi_periph/M05_ACLK] \
  [get_bd_pins microblaze_0_axi_periph/M06_ACLK] [get_bd_pins microblaze_0_axi_periph/M07_ACLK] [get_bd_pins spi/ext_spi_clk] \
  [get_bd_pins spi/s_axi_aclk] [get_bd_pins timer/s_axi_aclk]
connect_bd_net [get_bd_pins rst_clk_wiz_1_100M/bus_struct_reset] [get_bd_pins lmb/SYS_Rst]
connect_bd_net [get_bd_pins rst_clk_wiz_1_100M/interconnect_aresetn] [get_bd_pins microblaze_0_axi_periph/ARESETN]
connect_bd_net [get_bd_pins rst_clk_wiz_1_100M/mb_reset] [get_bd_pins mb/Reset]
connect_bd_net [get_bd_pins rst_clk_wiz_1_100M/peripheral_aresetn] \
  [get_bd_pins peripheral_aresetn] [get_bd_pins io_switch/s_axi_aresetn] [get_bd_pins gpio/s_axi_aresetn] \
  [get_bd_pins iic/s_axi_aresetn] [get_bd_pins intc/s_axi_aresetn] [get_bd_pins microblaze_0_axi_periph/S00_ARESETN] \
  [get_bd_pins microblaze_0_axi_periph/M00_ARESETN] [get_bd_pins microblaze_0_axi_periph/M01_ARESETN] \
  [get_bd_pins microblaze_0_axi_periph/M02_ARESETN] [get_bd_pins microblaze_0_axi_periph/M03_ARESETN] \
  [get_bd_pins microblaze_0_axi_periph/M04_ARESETN] [get_bd_pins microblaze_0_axi_periph/M05_ARESETN] \
  [get_bd_pins microblaze_0_axi_periph/M06_ARESETN] [get_bd_pins microblaze_0_axi_periph/M07_ARESETN] \
  [get_bd_pins spi/s_axi_aresetn] [get_bd_pins timer/s_axi_aresetn]
connect_bd_net [get_bd_pins s_axi_aresetn] [get_bd_pins intr/s_axi_aresetn] [get_bd_pins mb_bram_ctrl/s_axi_aresetn]
set_property HDL_ATTRIBUTE.BMM_INFO_PROCESSOR {microblaze-le > base iop_pmodb/lmb/lmb_bram_if_cntlr} [get_bd_cells mb]
set_property HDL_ATTRIBUTE.KEEP_HIERARCHY yes [get_bd_cells mb]
set_property HDL_ATTRIBUTE.BMM_INFO_ADDRESS_SPACE {byte  0x42000000 32 > base iop_pmodb/lmb/lmb_bram} [get_bd_cells mb_bram_ctrl]
set_property HDL_ATTRIBUTE.KEEP_HIERARCHY yes [get_bd_cells mb_bram_ctrl]
